# Altium schematic sheet Main.SchDoc
size A4
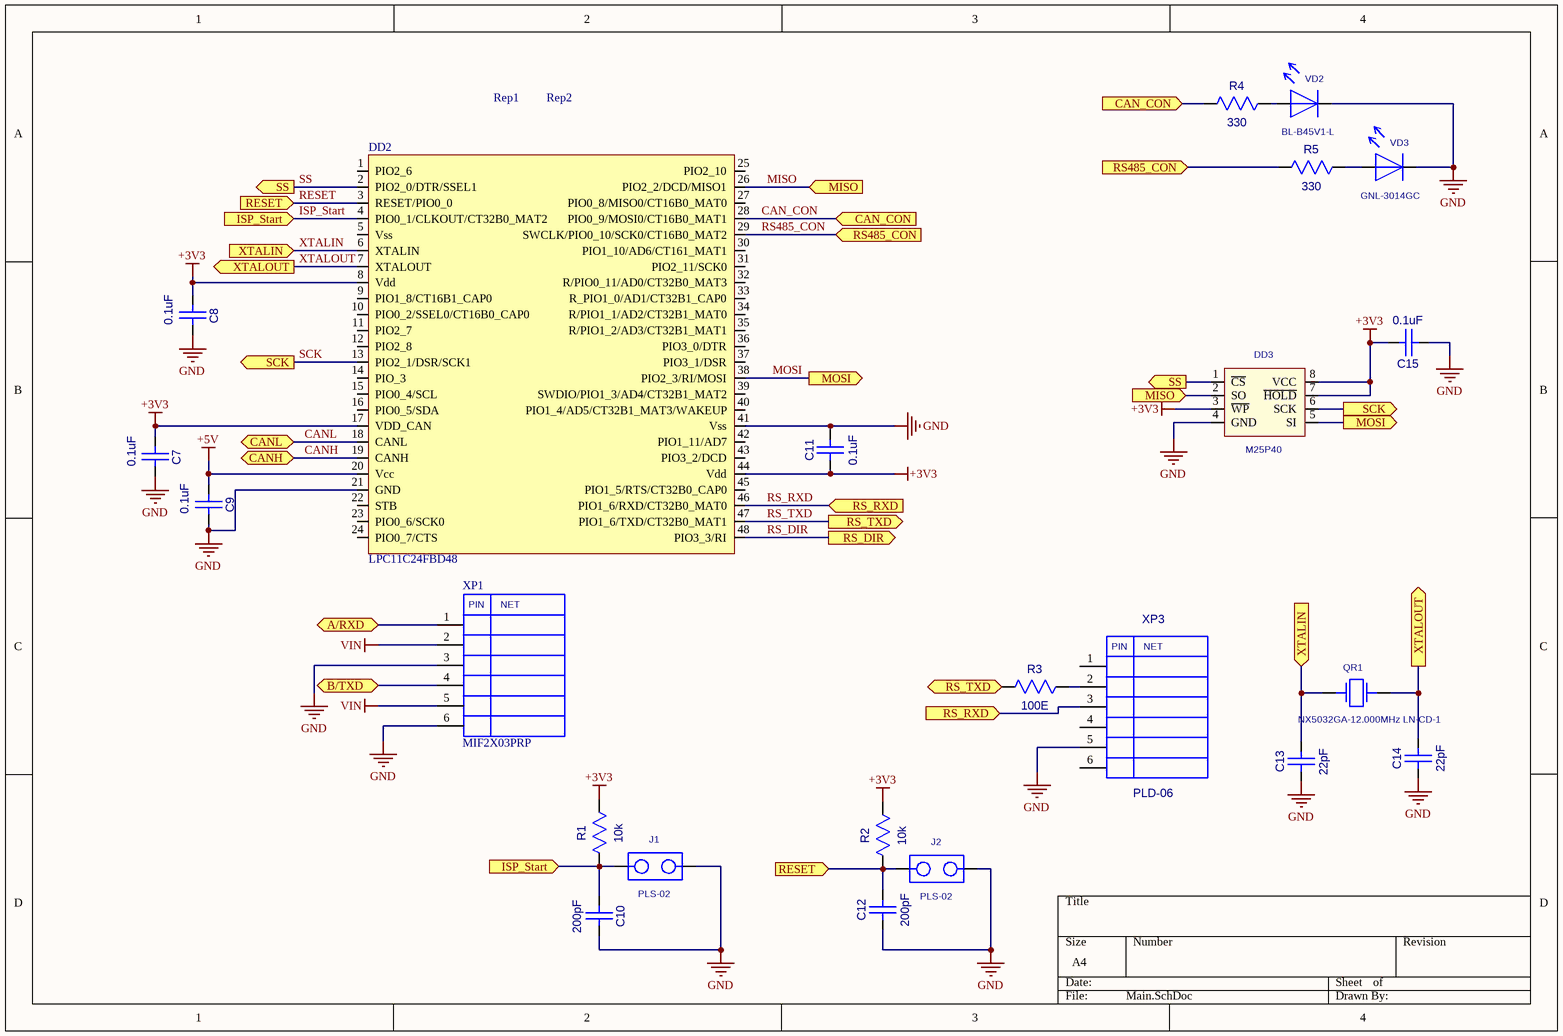
[diagram p0: Main.SchDoc]

## Parts
C7  0.1uF  [CC0603-3M]
C8  0.1uF  [CC0603-3M]
C9  0.1uF  [CC0603-3M]
C10  200pF  [CC0603-3M]
C11  0.1uF  [CC0603]
C12  200pF  [CC0603-3M]
C13  22pF  [CC0603-3M]
C14  22pF  [CC0603-3M]
C15  0.1uF  [CC0603-3M]
DD2  LPC11C24FBD48  [LQFP48]
DD3  M25P40  [EIAJ_SO8]
J1  PLS-02  [PLS-02]
J2  PLS-02  [PLS-02]
QR1  NX5032GA-12.000MHz LN-CD-1  [AC5032_2]
R1  10k  [RC0603-3M]
R2  10k  [RC0603-3M]
R3  100E  [RC0603-3M]
R4  330  [RC0603-3M]
R5  330  [RC0603-3M]
Rep1  REPER1.2  [REPER1.2]  (value not drawn)
Rep2  REPER1.2  [REPER1.2]  (value not drawn)
VD2  BL-B45V1-L  [LED3]
VD3  GNL-3014GC  [LED3]
XP1  MIF2X03PRP  [MIF2X03PRP]
XP3  PLD-06  [PIN6]

## Ports
A/RXD, B/TXD, CAN_CON (in), CANH, CANL, ISP_Start (in), MISO (in), MOSI (out), RESET (in), RS485_CON (in), RS_DIR (out), RS_RXD (in), RS_TXD (out), SCK (out), SS (out), XTALIN (in), XTALOUT (out)

## Nets
+3V3: C7.1(A) C8.1(A) C11.1(A) C15.2(B) DD2.8(Vdd) DD2.17(VDD_CAN) DD2.44(Vdd) DD3.3(~{WP}) DD3.7(~{HOLD}) DD3.8(VCC) R1.2(B) R2.2(B)
+5V: C9.1(A) DD2.20(Vcc)
GND: C7.2(B) C8.2(B) C9.2(B) C10.2(B) C11.2(B) C12.1(A) C13.1(A) C14.1(A) C15.1(A) DD2.21(GND) DD2.41(Vss) DD3.4(GND) J1.2 J2.2 VD2.1 VD3.1 XP1.3 XP1.6 XP3.5
VIN: XP1.2 XP1.5
A/RXD: XP1.1 ; port A/RXD
B/TXD: XP1.4 ; port B/TXD
CAN_CON: DD2.28(PIO0_9/MOSI0/CT16B0_MAT1) R4.1(A) ; port CAN_CON
CANH: DD2.19(CANH) ; port CANH
CANL: DD2.18(CANL) ; port CANL
ISP_Start: C10.1(A) DD2.4(PIO0_1/CLKOUT/CT32B0_MAT2) J1.1 R1.1(A) ; port ISP_Start
MISO: DD2.26(PIO2_2/DCD/MISO1) DD3.2(SO) ; port MISO
MOSI: DD2.38(PIO2_3/RI/MOSI) DD3.5(SI) ; port MOSI
RESET: C12.2(B) DD2.3(RESET/PIO0_0) J2.1 R2.1(A) ; port RESET
RS485_CON: DD2.29(SWCLK/PIO0_10/SCK0/CT16B0_MAT2) R5.1(A) ; port RS485_CON
RS_DIR: DD2.48(PIO3_3/RI) ; port RS_DIR
RS_RXD: DD2.46(PIO1_6/RXD/CT32B0_MAT0) XP3.3 ; port RS_RXD
RS_TXD: DD2.47(PIO1_6/TXD/CT32B0_MAT1) R3.1(A) ; port RS_TXD
SCK: DD2.13(PIO2_1/DSR/SCK1) DD3.6(SCK) ; port SCK
SS: DD2.2(PIO2_0/DTR/SSEL1) DD3.1(~{CS}) ; port SS
XTALIN: C13.2(B) DD2.6(XTALIN) QR1.1 ; port XTALIN
XTALOUT: C14.2(B) DD2.7(XTALOUT) QR1.2 ; port XTALOUT
NetR3_2: R3.2(B) XP3.2
NetR4_2: R4.2(B) VD2.2
NetR5_2: R5.2(B) VD3.2

Not connected (* = marked no-connect by the designer): DD2 1(PIO2_6) 5(Vss) 9(PIO1_8/CT16B1_CAP0) 10(PIO0_2/SSEL0/CT16B0_CAP0) 11(PIO2_7) 12(PIO2_8) 14(PIO_3) 15(PIO0_4/SCL) 16(PIO0_5/SDA) 22(STB) 23(PIO0_6/SCK0) 24(PIO0_7/CTS) 25(PIO2_10) 27(PIO0_8/MISO0/CT16B0_MAT0) 30(PIO1_10/AD6/CT161_MAT1) 31(PIO2_11/SCK0) 32(R/PIO0_11/AD0/CT32B0_MAT3) 33(R_PIO1_0/AD1/CT32B1_CAP0) 34(R/PIO1_1/AD2/CT32B1_MAT0) 35(R/PIO1_2/AD3/CT32B1_MAT1) 36(PIO3_0/DTR) 37(PIO3_1/DSR) 39(SWDIO/PIO1_3/AD4/CT32B1_MAT2) 40(PIO1_4/AD5/CT32B1_MAT3/WAKEUP) 42(PIO1_11/AD7) 43(PIO3_2/DCD) 45(PIO1_5/RTS/CT32B0_CAP0); Rep1 1; Rep2 1; XP3 1 4 6

## Notes on the sheet
- (in symbol MIF2X03PRP) PIN; NET
- (in symbol PLD-06) PIN; NET

## Library data of the parts
C7-C15 = CC0603
  C7-C9 C11 C15: Value: 0.1uF
  C10 C12: Value: 200pF
  C13 C14: Value: 22pF
DD3 = S25FL016A0LMFI01: Value: M25P40
QR1 = AC5032_2: AC5032/2; Value: NX5032GA-12.000MHz LN-CD-1
R1-R5 = RC0603
  R1 R2: Value: 10k
  R3: Value: 100E
  R4 R5: Value: 330
VD2 VD3 = LED_3
  VD2: Value: BL-B45V1-L
  VD3: Value: GNL-3014GC
XP3 = PLD-06: PLD06; Value: *
DD2 = LPC11C24FBD48: Value: LPC11C24FBD48
J1 J2 = PLS-02: Value: PLS-02
Rep1 Rep2 = REPER1.2: Value: *
XP1 = MIF2X03PRP: Value: *